# Altium schematic sheet BB_analog.SchDoc
size A
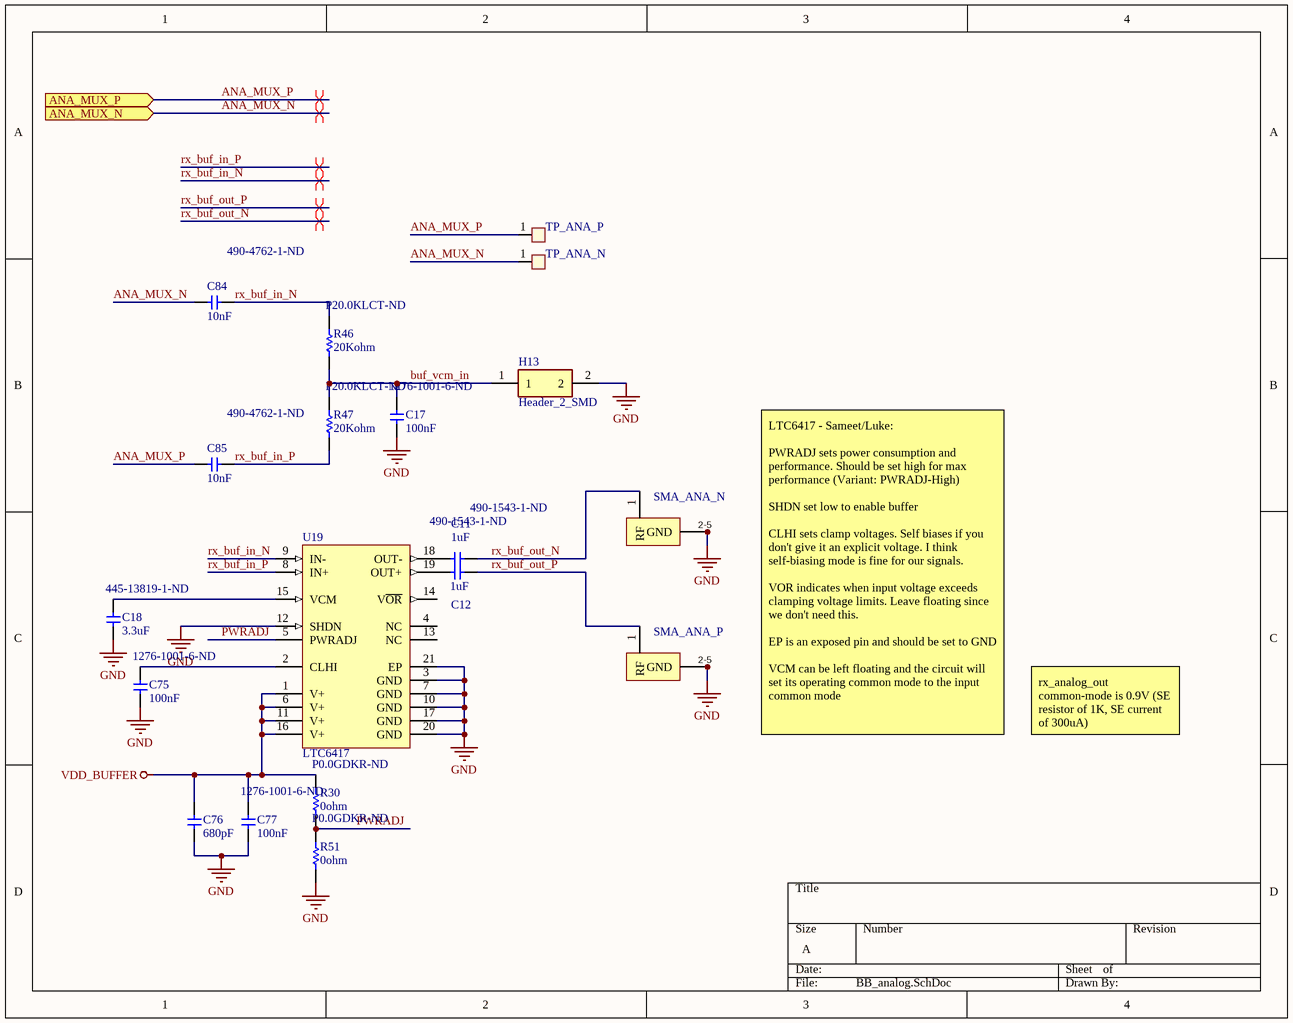
[diagram p0: BB_analog.SchDoc]

## Parts
C11  1uF  Supplier Part Number 1: 490-1543-1-ND  [CAP_0603]
C12  1uF  Supplier Part Number 1: 490-1543-1-ND  [CAP_0603]
C17  100nF  Supplier Part Number 1: 1276-1001-6-ND  [CAP_0402]
C18  3.3uF  Supplier Part Number 1: 445-13819-1-ND  [CAP_0402]
C75  100nF  Supplier Part Number 1: 1276-1001-6-ND  [CAP_0402]
C76  680pF  [CAP_0603]
C77  100nF  Supplier Part Number 1: 1276-1001-6-ND  [CAP_0402]
C84  10nF  Supplier Part Number 1: 490-4762-1-ND  [CAPC1005X06L_HD]
C85  10nF  Supplier Part Number 1: 490-4762-1-ND  [CAPC1005X06L_HD]
H13  Header_2_SMD  [HDR1X2_SMD_S]
R30  0ohm  Supplier Part Number 1: P0.0GDKR-ND  [RES_0603]
R46  20Kohm  Supplier Part Number 1: P20.0KLCT-ND  [RES_0402]
R47  20Kohm  Supplier Part Number 1: P20.0KLCT-ND  [RES_0402]
R51  0ohm  Supplier Part Number 1: P0.0GDKR-ND  [RES_0603]
SMA_ANA_N  CONSMA001-SMD-G  [CON-SMA-SMD]  (value not drawn)
SMA_ANA_P  CONSMA001-SMD-G  [CON-SMA-SMD]  (value not drawn)
TP_ANA_N  TestPoint_SMD  [TestPoint_SMD]  (value not drawn)
TP_ANA_P  TestPoint_SMD  [TestPoint_SMD]  (value not drawn)
U19  LTC6417  [LT-UDC-20_N_NPV]

## Ports
ANA_MUX_N (in), ANA_MUX_P (in)

## Nets
GND: C17.2 C18.2 C75.2 C76.2 C77.2 H13.2 R51.2(BOT) SMA_ANA_N.2(GND) SMA_ANA_N.3(GND) SMA_ANA_N.4(GND) SMA_ANA_N.5(GND) SMA_ANA_P.2(GND) SMA_ANA_P.3(GND) SMA_ANA_P.4(GND) SMA_ANA_P.5(GND) U19.3(GND) U19.7(GND) U19.10(GND) U19.12(SHDN) U19.17(GND) U19.20(GND) U19.21(EP)
VDD_BUFFER: C76.1 C77.1 R30.1(TOP) U19.1(V+) U19.6(V+) U19.11(V+) U19.16(V+)
ANA_MUX_N: C84.1 TP_ANA_N.1(TP) ; port ANA_MUX_N
ANA_MUX_P: C85.1 TP_ANA_P.1(TP) ; port ANA_MUX_P
buf_vcm_in: C17.1 H13.1 R46.2(BOT) R47.1(TOP)
PWRADJ: R30.2(BOT) R51.1(TOP) U19.5(PWRADJ)
rx_buf_in_N: C84.2 R46.1(TOP) U19.9(IN-)
rx_buf_in_P: C85.2 R47.2(BOT) U19.8(IN+)
rx_buf_out_N: C11.2 SMA_ANA_N.1(RF)
rx_buf_out_P: C12.1 SMA_ANA_P.1(RF)
NetC11_1: C11.1 U19.18(OUT-)
NetC12_2: C12.2 U19.19(OUT+)
NetC18_1: C18.1 U19.15(VCM)
NetC75_1: C75.1 U19.2(CLHI)

Not connected (* = marked no-connect by the designer): U19 4(NC) 13(NC) 14(V~{OR})

## Layout directives
differential pair: ANA_MUX_N, ANA_MUX_P, rx_buf_in_N, rx_buf_in_P, rx_buf_out_N, rx_buf_out_P

## Notes on the sheet
- LTC6417 - Sameet/Luke:
  PWRADJ sets power consumption and performance. Should be set high for max performance (Variant: PWRADJ-High)
  SHDN set low to enable buffer
  CLHI sets clamp voltages. Self biases if you don't give it an explicit voltage. I think self-biasing mode is fine for our signals.
  VOR indicates when input voltage exceeds clamping voltage limits. Leave floating since we don't need this.
  EP is an exposed pin and should be set to GND
  VCM can be left floating and the circuit will set its operating common mode to the input common mode
- rx_analog_out common-mode is 0.9V (SE resistor of 1K, SE current of 300uA)
- (in symbol SURFACE MOUNT SMA CONNECTOR) 2-5

## Library data of the parts
C11 C12 = cap 1uF 0603: CAP CER 1uF 10% 10V X5R 0603; Manufacturer: Murata; Manufacturer ID: GRM188R61A105KA61D; Digikey ID: 490-1543-1-ND; Value: 1uF; Package: 0603; Supplier 1: Digi-Key
C17 C75 C77 = cap 100nF: CAP CER 0.1uF 10% 16V X7R 0402; Manufacturer: Samsung Electro-Mechanics; Manufacturer ID: CL05B104KO5NNNC; Digikey ID: 1276-1001-1-ND; Value: 0.1uF; Package: 0402; Supplier 1: Digi-Key
C18 = cap 3p3uF: CAP CER 3.3uF 10% 10V X5R 0402; Manufacturer: TDK; Manufacturer ID: C1005X5R1A335K050BC; Digikey ID: 445-13819-1-ND; Value: 3.3uF; Package: 0402; Supplier 1: Digi-Key
C76 = cap 680pF 0603: CAP CER 680pF 5% 25V C0G/NP0 0603; Manufacturer: Kemet; Manufacturer ID: C0603C681J3GACTU; Package: 0603; Supplier 1: Digi-Key; Supplier Part Number 1: 399-7949-1-ND; Capacitance: 680pF
C84 C85 = cap 10nF: CAP CER 10nF 10% 50V X7R 0402; Manufacturer: Murata; Manufacturer ID: GCM155R71H103KA55D; Value: 10000pF; Digikey ID: 490-4762-1-ND; Package: 0402; Supplier 1: Digi-Key
H13 = Header_2_SMD: Connector Header Vertical, SMD, 2 position 0.100" (2.54mm); Manufacturer_Name: SAMTEC; Manufacturer_Part_Number: TSM-102-01-S-SV; Datasheet Link: https://componentsearchengine.com/Datasheets/2/TSM-102-01-S-SV.pdf; Arrow Part Number: TSM-102-01-S-SV; Arrow Price/Stock: https://www.arrow.com/en/products/tsm-102-01-s-sv/samtec; Mouser Part Number: 200-TSM10201SSV; Mouser Price/Stock: https://www.mouser.co.uk/ProductDetail/Samtec/TSM-102-01-S-SV?qs=FESYatJ8odJNSemiJZ%2Fyzw%3D%3D; Supplier 1: Digi-Key; Supplier Part Number 1: SAM10783-ND
R30 R51 = res 0 ohm 0603: RES SMD 0 OHM JUMPER 1/10W 0603; Manufacturer: Panasonic; Manufacturer ID: ERJ-3GEY0R00V; Digikey ID: P0.0GCT-ND; Package: 0603; Supplier 1: Digi-Key
R46 R47 = res 20 Kohm: RES SMD 20k OHM 1% 1/10W 0402; Manufacturer: Panasonic; Manufacturer ID: ERJ-2RKF2002X; Digikey ID: P20.0KLCT-ND; Package: 0402; Supplier 1: Digi-Key
SMA_ANA_N SMA_ANA_P = SURFACE MOUNT SMA CONNECTOR: SMD SMA CONNECTOR; Manufacturer 1: Linx Technologies; Supplier 1: Digi-Key; Supplier Part Number 1: CONSMA001-SMD-ND; Manufacturer Part Number 1: CONSMA001-SMD-G; Manufacturer Part Number 2: CONSMA002-SMD; Supplier Part Number 2: CONSMA002-SMD-ND
TP_ANA_N TP_ANA_P = TestPoint_SMD: Test Point, SMD 1mm x 1.8mm, 1.15mm high.; Supplier 1: Digi-Key; Supplier Part Number 1: 952-2665-1-ND
U19 = LTC6417CUDC#PBF: Single Channel, Low Noise, High Linearity Differential Buffer / 16-Bit ADC Driver with Fast Clamp, 1600 MHz Typical GBW, 10000 V/us Typical SR, 4.75 to 5.25 V, 20-Pin QFN (UDC20), Commercial, Pb-Free; Manufacturer: Linear Technology; Channels (#): 1; GBW (MHz) Typical: 1600; Is (mA) Typical: 123; SR (V/us) Typical: 10000; Vos (mV) Typical: 0.1; Vs Max (V): 5.25; Vs Min (V): 4.75; PackageVersion: Rev Ø; PackageReference: LT-UDC-20; PackageDescription: 20-Lead Plastic QFN, Body 3 x 4 mm, Pitch 0.5 mm; Supplier 1: Digi-Key; Supplier Part Number 1: LTC6417CUDC#PBF-ND; Supplier 2: Farnell; Supplier Part Number 2: 2322431; Supplier 3: Newark; Supplier Part Number 3: 27W9503; Linear Technology Part Number: LTC6417; RoHS: Pb-Free; Type: DIFF; Mounting Technology: Surface Mount; PartNumber: LTC6417CUDC#PBF; ComponentLink1Description: Manufacturer URL; ComponentLink1URL: http://www.linear.com/; ComponentLink2Description: Datasheet; ComponentLink2URL: http://cds.linear.com/docs/en/datasheet/6417f.pdf; ComponentLink3Description: Package Specification; ComponentLink3URL: http://cds.linear.com/docs/en/packaging/QFN_20_05-08-1742.pdf; Digikey ID: LTC6417CUDC#PBF-ND; Manufacturer ID: LTC6417CUDC#PBF